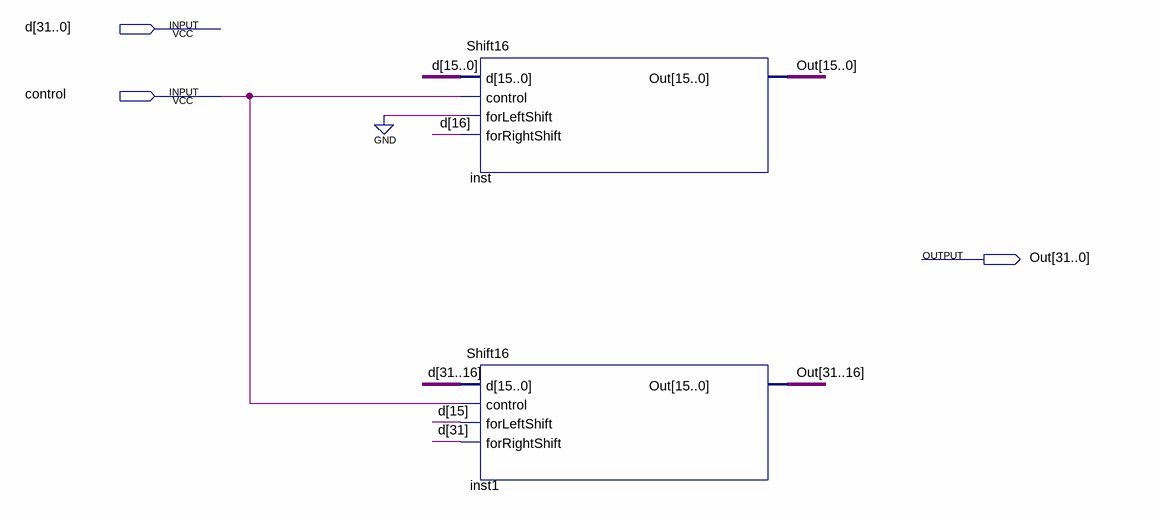
[diagram p0: schematic sheet]
// Quartus schematic Shift32.bdf as structural Verilog: 2 symbols, 3 pins
module Shift32 (
  input  [31:0] d,
  input  control,
  output [31:0] Out
);

  Shift16 inst (.d(d[15:0]), .control(control), .forLeftShift(1'b0), .forRightShift(d[16]), .Out(Out[15:0]));
  Shift16 inst1 (.d(d[31:16]), .control(control), .forLeftShift(d[15]), .forRightShift(d[31]), .Out(Out[31:16]));
endmodule
